# Altium schematic sheet E17-PDU-3-CONNECTORS.SchDoc
size A4
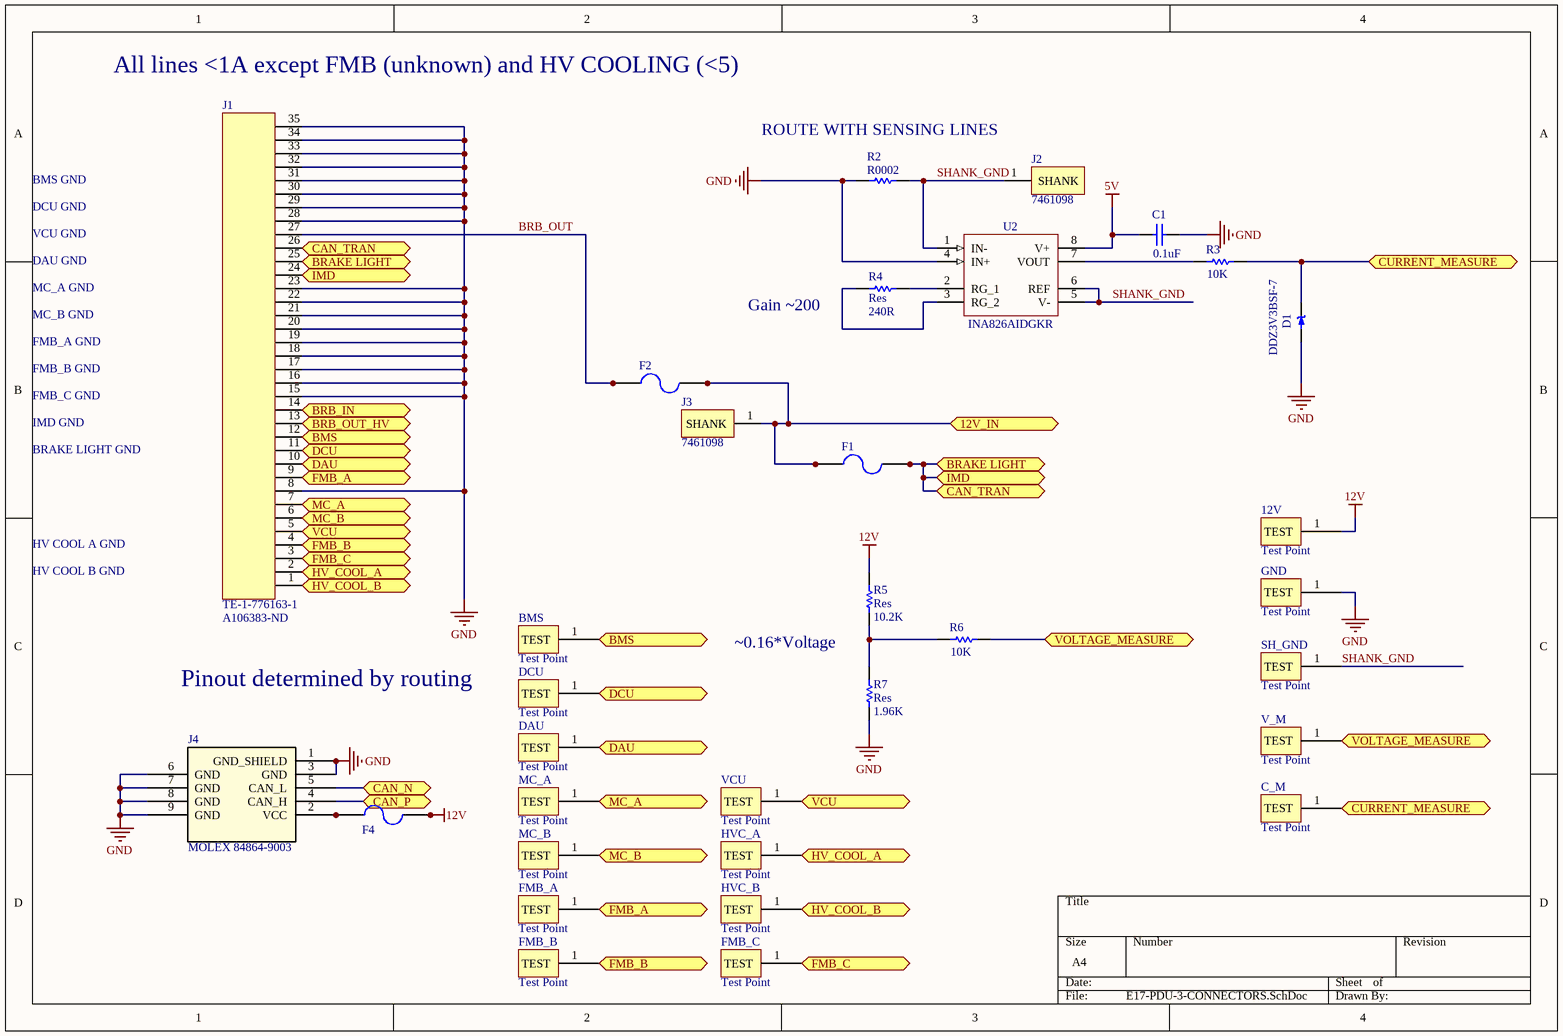
[diagram p0: E17-PDU-3-CONNECTORS.SchDoc]

## Parts
12V  Test Point  [TEST POINT 5000K]
BMS  Test Point  [TEST POINT 5000K]
C1  value 0.1uF  [C0805]  (hidden comment: Cap)
C_M  Test Point  [TEST POINT 5000K]
D1  value DDZ3V3BSF-7  [DDZ3V3BSF-7]  (hidden comment: D_DDZ3V3BSF-7)
DAU  Test Point  [TEST POINT 5000K]
DCU  Test Point  [TEST POINT 5000K]
F1  BK-6013  [BK-6013]  (value not drawn)
F2  BK-6013  [BK-6013]  (value not drawn)
F4  BK-6013  [BK-6013]  (value not drawn)
FMB_A  Test Point  [TEST POINT 5000K]
FMB_B  Test Point  [TEST POINT 5000K]
FMB_C  Test Point  [TEST POINT 5000K]
GND  Test Point  [TEST POINT 5000K]
HVC_A  Test Point  [TEST POINT 5000K]
HVC_B  Test Point  [TEST POINT 5000K]
J1  TE-1-776163-1  Supplier Part Number 1: A106383-ND  [TE-1-776163-1]
J2  7461098  [7461098]
J3  7461098  [7461098]
J4  MOLEX 84864-9003  [MOLEX 84864-9003]
MC_A  Test Point  [TEST POINT 5000K]
MC_B  Test Point  [TEST POINT 5000K]
R2  value R0002  [PSR500HTQFC0L20]  (hidden comment: R_PSR500HTQFC0L20)
R3  value 10K  [2012[0805]]  (hidden comment: Res)
R4  Res  value 240R  [2012[0805]]
R5  Res  value 10.2K  [2012[0805]]
R6  value 10K  [2012[0805]]  (hidden comment: Res)
R7  Res  value 1.96K  [2012[0805]]
SH_GND  Test Point  [TEST POINT 5000K]
U2  value INA826AIDGKR  [8-TSSOP]  (hidden comment: U_INA826AIDGKR - not in use)
V_M  Test Point  [TEST POINT 5000K]
VCU  Test Point  [TEST POINT 5000K]

## Ports
12V_IN, BMS, BRAKE LIGHT, BRB_IN, BRB_OUT_HV, CAN_N, CAN_P, CAN_TRAN, CURRENT_MEASURE, DAU, DCU, FMB_A, FMB_B, FMB_C, HV_COOL_A, HV_COOL_B, IMD, MC_A, MC_B, VCU, VOLTAGE_MEASURE

## Nets
5V: C1.1 U2.8(V+)
12V: 12V.1(TEST) F4.3 F4.4 R5.2
GND: C1.2 D1.1 GND.1(TEST) J1.8 J1.15 J1.16 J1.17 J1.18 J1.19 J1.20 J1.21 J1.22 J1.23 J1.28 J1.29 J1.30 J1.31 J1.32 J1.33 J1.34 J1.35 J4.1(GND_SHIELD) J4.3(GND) J4.6(GND) J4.7(GND) J4.8(GND) J4.9(GND) R2.1 R7.1 U2.4(IN+)
12V_IN: F1.1 F1.2 F2.3 F2.4 J3.1(SHANK) ; port 12V_IN
BMS: BMS.1(TEST) J1.12 ; port BMS
BRAKE LIGHT: F1.3 F1.4 J1.24 J1.25 J1.26 ; port IMD, port BRAKE LIGHT, port CAN_TRAN
BRB_IN: J1.14 ; port BRB_IN
BRB_OUT: F2.1 F2.2 J1.27
BRB_OUT_HV: J1.13 ; port BRB_OUT_HV
CAN_N: J4.5(CAN_L) ; port CAN_N
CAN_P: J4.4(CAN_H) ; port CAN_P
CURRENT_MEASURE: C_M.1(TEST) D1.2 R3.1 ; port CURRENT_MEASURE
DAU: DAU.1(TEST) J1.10 ; port DAU
DCU: DCU.1(TEST) J1.11 ; port DCU
FMB_A: FMB_A.1(TEST) J1.9 ; port FMB_A
FMB_B: FMB_B.1(TEST) J1.4 ; port FMB_B
FMB_C: FMB_C.1(TEST) J1.3 ; port FMB_C
HV_COOL_A: HVC_A.1(TEST) J1.2 ; port HV_COOL_A
HV_COOL_B: HVC_B.1(TEST) J1.1 ; port HV_COOL_B
MC_A: J1.7 MC_A.1(TEST) ; port MC_A
MC_B: J1.6 MC_B.1(TEST) ; port MC_B
SHANK_GND: J2.1(SHANK) R2.2 SH_GND.1(TEST) U2.1(IN-) U2.5(V-) U2.6(REF)
VCU: J1.5 VCU.1(TEST) ; port VCU
VOLTAGE_MEASURE: R6.1 V_M.1(TEST) ; port VOLTAGE_MEASURE
NetF4_1: F4.1 F4.2 J4.2(VCC)
NetR3_2: R3.2 U2.7(VOUT)
NetR4_1: R4.1 U2.3(RG_2)
NetR4_2: R4.2 U2.2(RG_1)
NetR5_1: R5.1 R6.2 R7.2

## Notes on the sheet
- (near J1) All lines <1A except FMB (unknown) and HV COOLING (<5)
- (near R2) ROUTE WITH SENSING LINES
- BMS GND
- DCU GND
- VCU GND
- DAU GND
- MC_A GND
- (near R4) Gain ~200
- MC_B GND
- FMB_A GND
- FMB_B GND
- FMB_C GND
- IMD GND
- BRAKE LIGHT GND
- HV COOL A GND
- HV COOL B GND
- ~0.16*Voltage
- Pinout determined by routing

## Library data of the parts
12V BMS C_M DAU DCU FMB_A FMB_B FMB_C GND HVC_A HVC_B MC_A MC_B SH_GND V_M VCU = Test Point: 5000-5004, 5015-5019 Keystone Electronics
C1 = Cap: Capacitor; Published: 8-Jun-2000; LatestRevisionDate: 17-Jul-2002; LatestRevisionNote: Re-released for DXP Platform.; PackageReference: C1206; Publisher: Altium Limited
D1 = D_DDZ3V3BSF-7: ZENER DIODE 3.43V; MFG: Diodes Incorporated; MFG_PN: DDZ3V3BSF-7; Supplier 1: Digi-Key; Supplier Part Number 1: DDZ3V3BSF-7DICT-ND
F1 F2 F4 = BK-6013: FUSE HOLDER BLADE PCB; Supplier 1: Digi-Key; Supplier Part Number 1: BK-6013-ND
J1 = TE-1-776163-1: CONN HEADER 35POS R/A GOLD BLACK; Supplier 1: Digi-Key
J2 J3 = 7461098: POWER ELEMENT SHANK M6 25PIN; MFG NOTE: Need to dimension; Supplier 1: Digi-Key; Supplier Part Number 1: 732-3278-ND
J4 = MOLEX 84864-9003: CAN Micro-Change M12, Right Angle, Male
R2 = R_PSR500HTQFC0L20: Resistor 0.0005ohm 5W Current Sense; MFG: Rohm; MFG_PN: PSR500HTQFC0L20; Supplier 1: Digi-Key; Supplier Part Number 1: RHM1679-CT-ND
R3-R7 = Res: Surface Mount Resistor; Published: 8-Jun-2000; LatestRevisionDate: 17-Jul-2002; LatestRevisionNote: Re-released for DXP Platform.; PackageReference: AXIAL-0.5; Publisher: Altium Limited
U2 = U_INA826AIDGKR - not in use: Opamp Instrumentation 2.7-36V SS; MFG: TI; MFG_PN: INA826AIDGKR; Supplier 1: Digi-Key; Supplier Part Number 1: 296-29663-1-ND